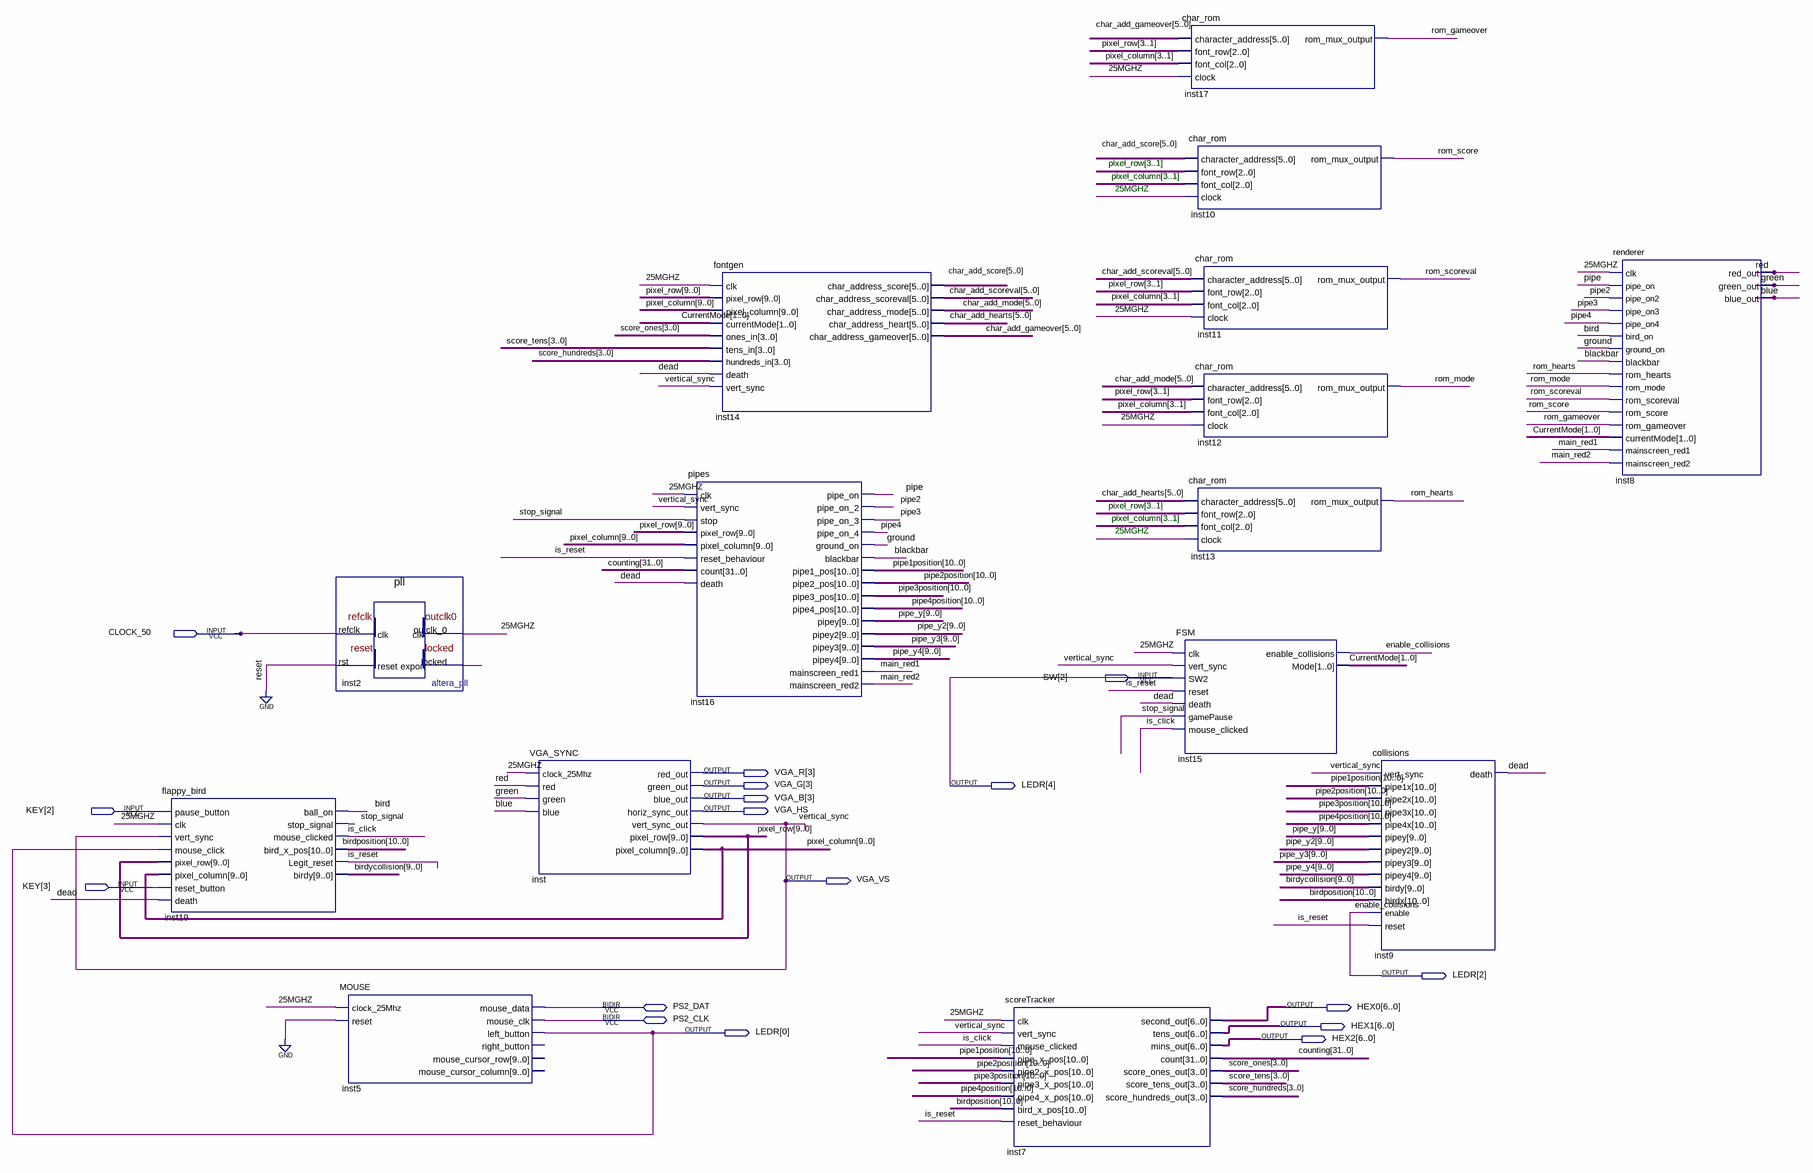
[diagram p0: schematic sheet]
// Quartus schematic FlappyBird.bdf as structural Verilog: 15 symbols, 17 pins
module FlappyBird (
  input  CLOCK_50,
  input  [2:2] SW,
  input  [3:2] KEY,
  inout  PS2_DAT,
  inout  PS2_CLK,
  output [3:3] VGA_R,
  output [3:3] VGA_G,
  output [4:0] LEDR,
  output [3:3] VGA_B,
  output VGA_HS,
  output VGA_VS,
  output [6:0] HEX0,
  output [6:0] HEX1,
  output [6:0] HEX2
);

  wire \25MGHZ , bird, blackbar, blue, dead, green, ground, inst2_locked, is_click, is_reset, main_red1,
       main_red2, pipe, pipe2, pipe3, pipe4, red, rom_gameover, rom_hearts, rom_mode, rom_score,
       rom_scoreval, stop_signal;
  wire [1:0] CurrentMode;
  wire [3:0] score_hundreds, score_ones, score_tens;
  wire [5:0] char_add_gameover, char_add_hearts, char_add_mode, char_add_score, char_add_scoreval;
  wire [9:0] birdycollision, pipe_y, pipe_y2, pipe_y3, pipe_y4, pixel_column, pixel_row;
  wire [10:0] birdposition, pipe1position, pipe2position, pipe3position, pipe4position;
  wire [31:0] counting;

  flappy_bird inst19 (
    .pause_button(KEY[2]), .clk(\25MGHZ ), .vert_sync(VGA_VS), .mouse_click(LEDR[0]), .pixel_row(pixel_row),
    .pixel_column(pixel_column), .reset_button(KEY[3]), .death(dead), .ball_on(bird),
    .stop_signal(stop_signal), .mouse_clicked(is_click), .bird_x_pos(birdposition), .Legit_reset(is_reset),
    .birdy(birdycollision));
  pll inst2 (.refclk(CLOCK_50), .rst(1'b0), .outclk_0(\25MGHZ ), .locked(inst2_locked));
  MOUSE inst5 (
    .clock_25Mhz(\25MGHZ ), .reset(1'b0), .left_button(LEDR[0]), .mouse_data(PS2_DAT), .mouse_clk(PS2_CLK));  // open: right_button, mouse_cursor_row, mouse_cursor_column
  VGA_SYNC inst (
    .clock_25Mhz(\25MGHZ ), .red(red), .green(green), .blue(blue), .red_out(VGA_R[3]), .green_out(VGA_G[3]),
    .blue_out(VGA_B[3]), .horiz_sync_out(VGA_HS), .vert_sync_out(VGA_VS), .pixel_row(pixel_row),
    .pixel_column(pixel_column));
  pipes inst16 (
    .clk(\25MGHZ ), .vert_sync(VGA_VS), .stop(stop_signal), .pixel_row(pixel_row),
    .pixel_column(pixel_column), .reset_behaviour(is_reset), .count(counting), .death(dead), .pipe_on(pipe),
    .pipe_on_2(pipe2), .pipe_on_3(pipe3), .pipe_on_4(pipe4), .ground_on(ground), .blackbar(blackbar),
    .pipe1_pos(pipe1position), .pipe2_pos(pipe2position), .pipe3_pos(pipe3position),
    .pipe4_pos(pipe4position), .pipey(pipe_y), .pipey2(pipe_y2), .pipey3(pipe_y3), .pipey4(pipe_y4),
    .mainscreen_red1(main_red1), .mainscreen_red2(main_red2));
  fontgen inst14 (
    .clk(\25MGHZ ), .pixel_row(pixel_row), .pixel_column(pixel_column), .currentMode(CurrentMode),
    .ones_in(score_ones), .tens_in(score_tens), .hundreds_in(score_hundreds), .death(dead),
    .vert_sync(VGA_VS), .char_address_score(char_add_score), .char_address_scoreval(char_add_scoreval),
    .char_address_mode(char_add_mode), .char_address_heart(char_add_hearts),
    .char_address_gameover(char_add_gameover));
  scoreTracker inst7 (
    .clk(\25MGHZ ), .vert_sync(VGA_VS), .mouse_clicked(is_click), .pipe_x_pos(pipe1position),
    .pipe2_x_pos(pipe2position), .pipe3_x_pos(pipe3position), .pipe4_x_pos(pipe4position),
    .bird_x_pos(birdposition), .reset_behaviour(is_reset), .second_out(HEX0), .tens_out(HEX1),
    .mins_out(HEX2), .count(counting), .score_ones_out(score_ones), .score_tens_out(score_tens),
    .score_hundreds_out(score_hundreds));
  char_rom inst17 (
    .character_address(char_add_gameover), .font_row(pixel_row[3:1]), .font_col(pixel_column[3:1]),
    .clock(\25MGHZ ), .rom_mux_output(rom_gameover));
  char_rom inst10 (
    .character_address(char_add_score), .font_row(pixel_row[3:1]), .font_col(pixel_column[3:1]),
    .clock(\25MGHZ ), .rom_mux_output(rom_score));
  char_rom inst11 (
    .character_address(char_add_scoreval), .font_row(pixel_row[3:1]), .font_col(pixel_column[3:1]),
    .clock(\25MGHZ ), .rom_mux_output(rom_scoreval));
  char_rom inst12 (
    .character_address(char_add_mode), .font_row(pixel_row[3:1]), .font_col(pixel_column[3:1]),
    .clock(\25MGHZ ), .rom_mux_output(rom_mode));
  char_rom inst13 (
    .character_address(char_add_hearts), .font_row(pixel_row[3:1]), .font_col(pixel_column[3:1]),
    .clock(\25MGHZ ), .rom_mux_output(rom_hearts));
  FSM inst15 (
    .clk(\25MGHZ ), .vert_sync(VGA_VS), .SW2(SW[2]), .reset(is_reset), .death(dead), .gamePause(stop_signal),
    .mouse_clicked(is_click), .enable_collisions(LEDR[2]), .Mode(CurrentMode));
  collisions inst9 (
    .vert_sync(VGA_VS), .pipe1x(pipe1position), .pipe2x(pipe2position), .pipe3x(pipe3position),
    .pipe4x(pipe4position), .pipey(pipe_y), .pipey2(pipe_y2), .pipey3(pipe_y3), .pipey4(pipe_y4),
    .birdy(birdycollision), .birdx(birdposition), .enable(LEDR[2]), .reset(is_reset), .death(dead));
  renderer inst8 (
    .clk(\25MGHZ ), .pipe_on(pipe), .pipe_on2(pipe2), .pipe_on3(pipe3), .pipe_on4(pipe4), .bird_on(bird),
    .ground_on(ground), .blackbar(blackbar), .rom_hearts(rom_hearts), .rom_mode(rom_mode),
    .rom_scoreval(rom_scoreval), .rom_score(rom_score), .rom_gameover(rom_gameover),
    .currentMode(CurrentMode), .mainscreen_red1(main_red1), .mainscreen_red2(main_red2), .red_out(red),
    .green_out(green), .blue_out(blue));

  assign LEDR[4] = SW[2];

  // Other names for the same wires on the sheet: enable_collisions = LEDR[2]; vertical_sync = VGA_VS

  // Notes on the sheet:
  //   pixel_row[3..1]
  //   pixel_column[3..1]
  //   25MGHZ
  //   pixel_row[3..1]
  //   pixel_column[3..1]
  //   25MGHZ
endmodule
